# EAGLE schematic OpenOTA-SMD (EAGLE 7.2.0)
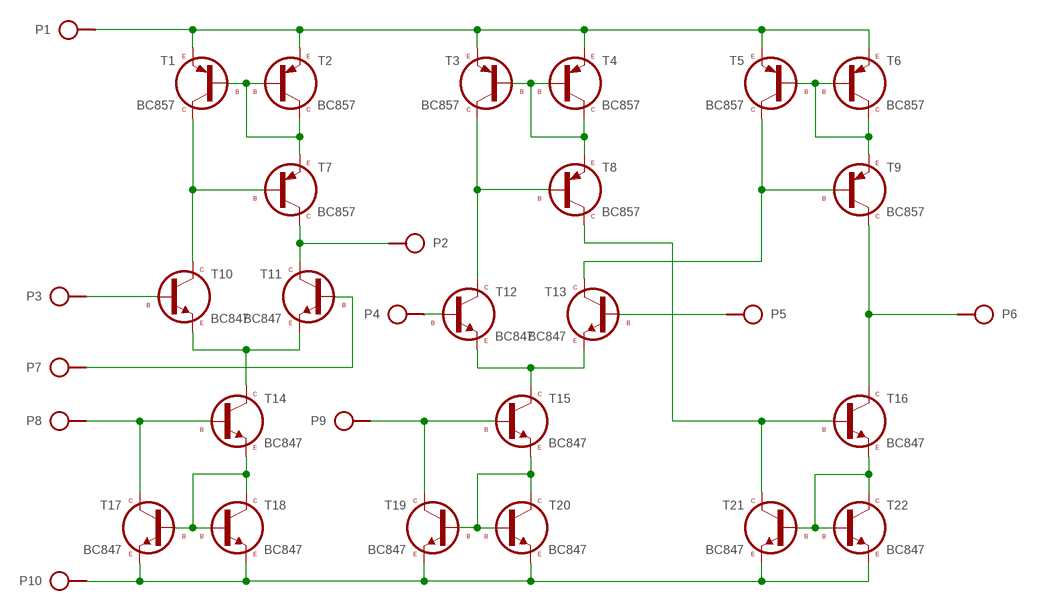
[diagram p0: schematic, sheet 1]

## Parts
P1  SPAD  [SPAD]
P2  SPAD  [SPAD]
P3  SPAD  [SPAD]
P4  SPAD  [SPAD]
P5  SPAD  [SPAD]
P6  SPAD  [SPAD]
P7  SPAD  [SPAD]
P8  SPAD  [SPAD]
P9  SPAD  [SPAD]
P10  SPAD  [SPAD]
T1  BC857  [SOT-23]
T2  BC857  [SOT-23]
T3  BC857  [SOT-23]
T4  BC857  [SOT-23]
T5  BC857  [SOT-23]
T6  BC857  [SOT-23]
T7  BC857  [SOT-23]
T8  BC857  [SOT-23]
T9  BC857  [SOT-23]
T10  BC847  [SOT-23]
T11  BC847  [SOT-23]
T12  BC847  [SOT-23]
T13  BC847  [SOT-23]
T14  BC847  [SOT-23]
T15  BC847  [SOT-23]
T16  BC847  [SOT-23]
T17  BC847  [SOT-23]
T18  BC847  [SOT-23]
T19  BC847  [SOT-23]
T20  BC847  [SOT-23]
T21  BC847  [SOT-23]
T22  BC847  [SOT-23]

## Nets
+15: P1.1 T1.2(E) T2.2(E) T3.2(E) T4.2(E) T5.2(E) T6.2(E)
-15: P10.1 T17.2(E) T18.2(E) T19.2(E) T20.2(E) T21.2(E) T22.2(E)
I_A: P8.1 T14.1(B) T17.3(C)
I_B: P9.1 T15.1(B) T19.3(C)
IN_A+: P3.1 T10.1(B)
IN_A-: P7.1 T11.1(B)
IN_B+: P5.1 T13.1(B)
IN_B-: P4.1 T12.1(B)
IO_A: P2.1 T7.3(C) T11.3(C)
N$2: T1.1(B) T2.1(B) T2.3(C) T7.2(E)
N$3: T1.3(C) T7.1(B) T10.3(C)
N$5: T12.2(E) T13.2(E) T15.3(C)
N$6: T3.1(B) T4.1(B) T4.3(C) T8.2(E)
N$7: T3.3(C) T8.1(B) T12.3(C)
N$8: T10.2(E) T11.2(E) T14.3(C)
N$9: T8.3(C) T16.1(B) T21.3(C)
N$10: T5.1(B) T6.1(B) T6.3(C) T9.2(E)
N$11: T5.3(C) T9.1(B) T13.3(C)
N$15: T14.2(E) T17.1(B) T18.1(B) T18.3(C)
N$18: T15.2(E) T19.1(B) T20.1(B) T20.3(C)
N$21: T16.2(E) T21.1(B) T22.1(B) T22.3(C)
OB: P6.1 T9.3(C) T16.3(C)

## Library data of the parts
P1-P10 = pad:SPAD
T1-T9 = t:BC857: PNP Transistor
T10-T22 = t:BC847: NPN Transistor